# EAGLE design controller (EAGLE 6.5.0)
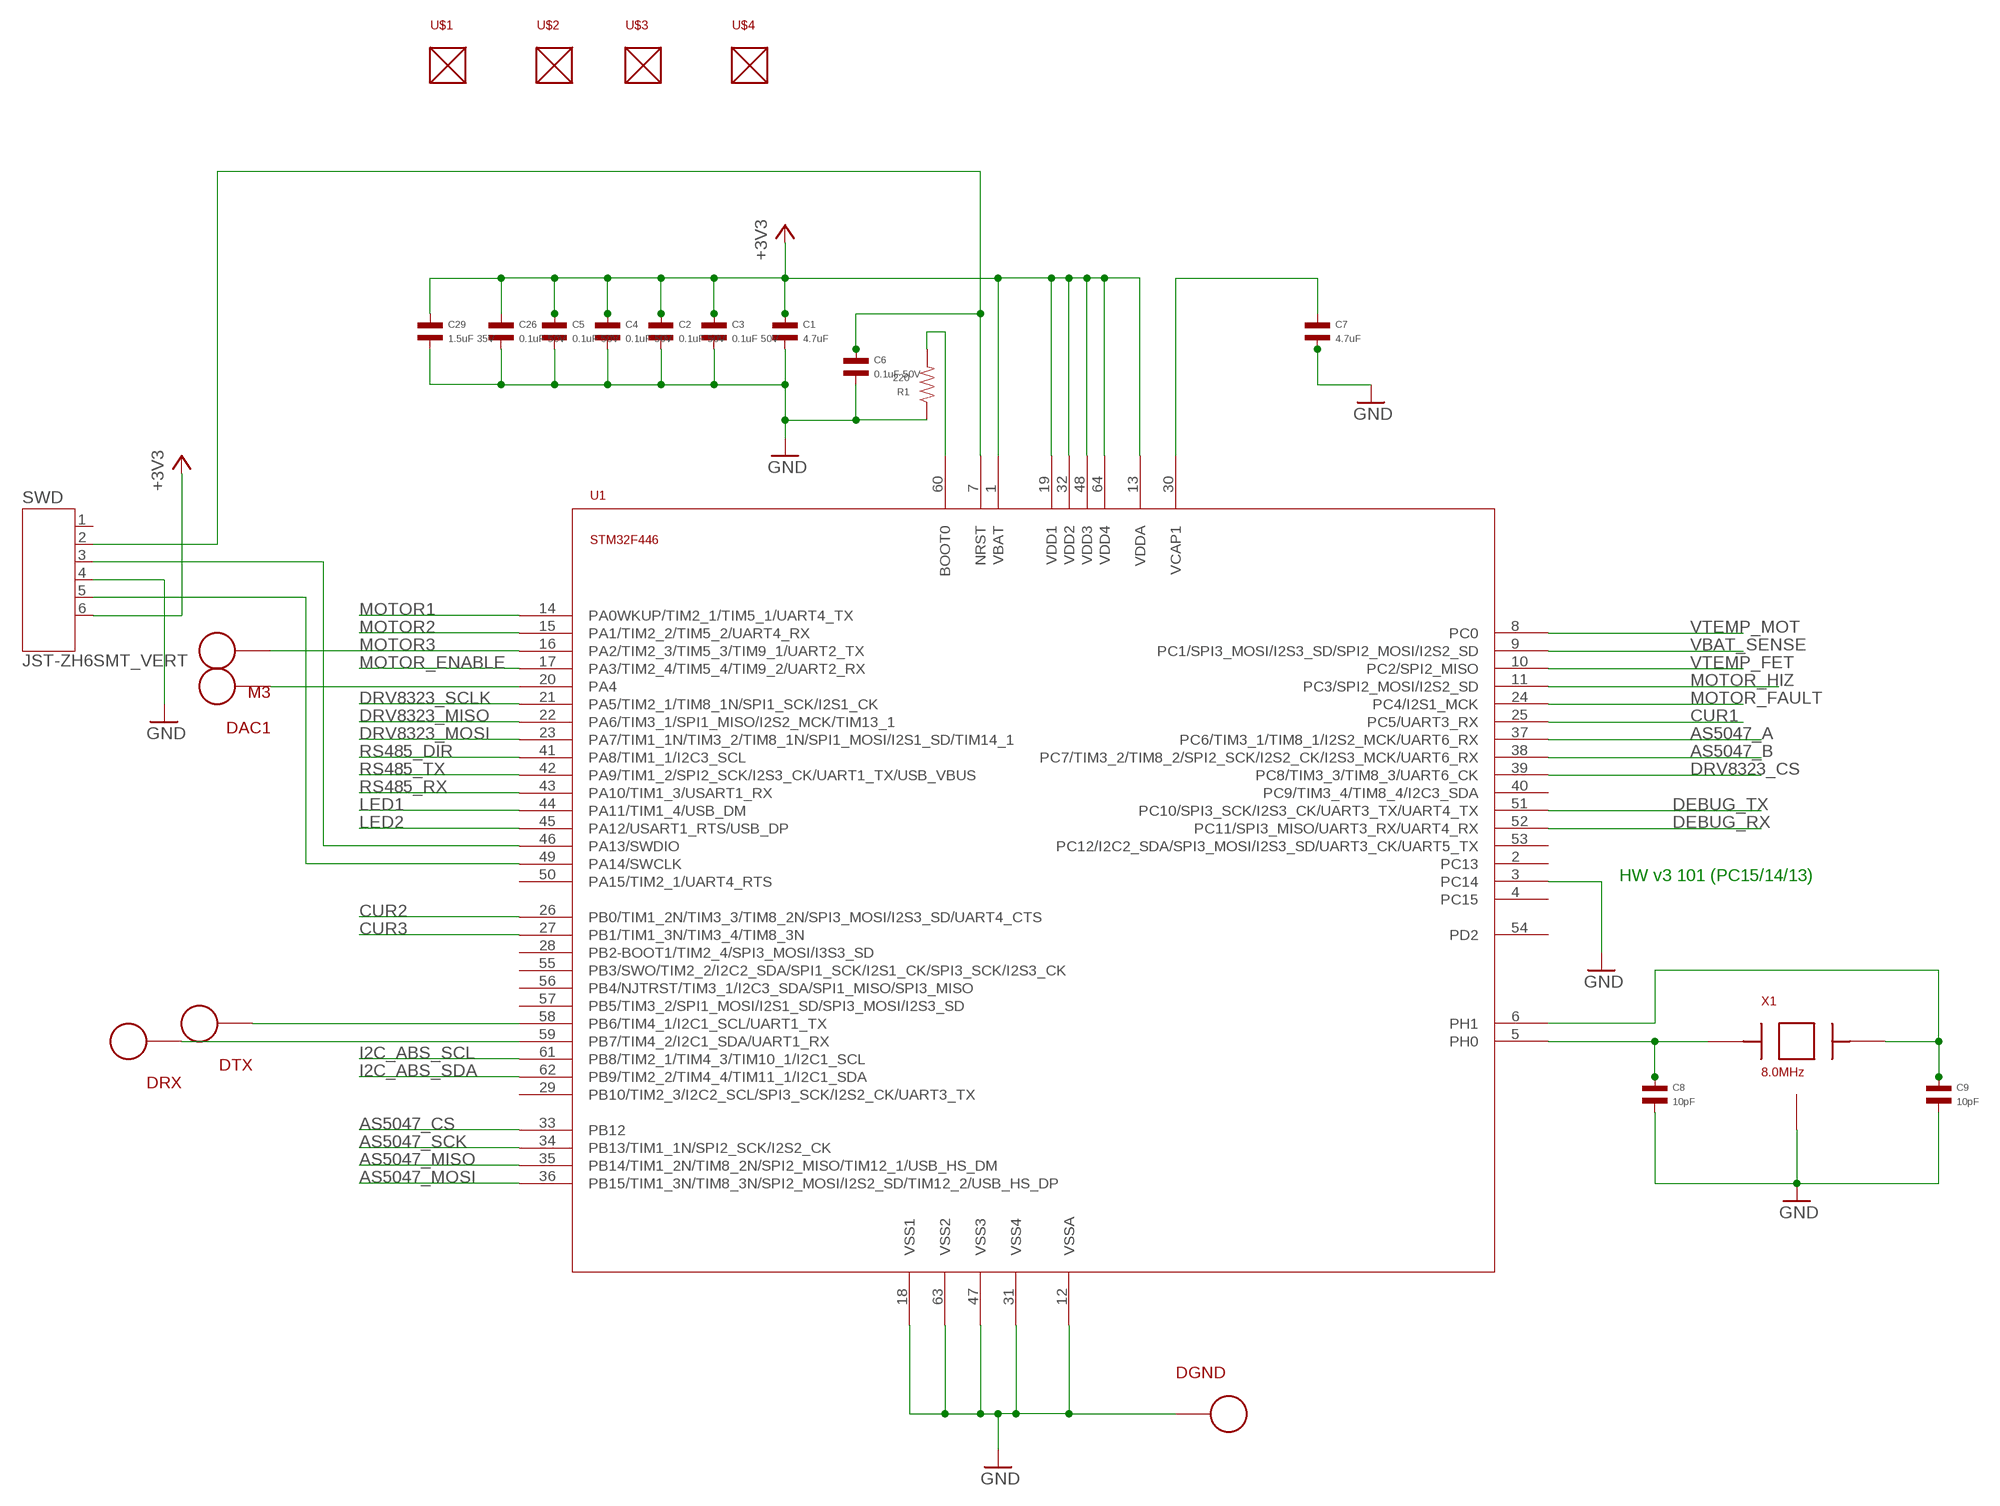
[diagram p0: schematic, sheet 1, part 1 of 2]
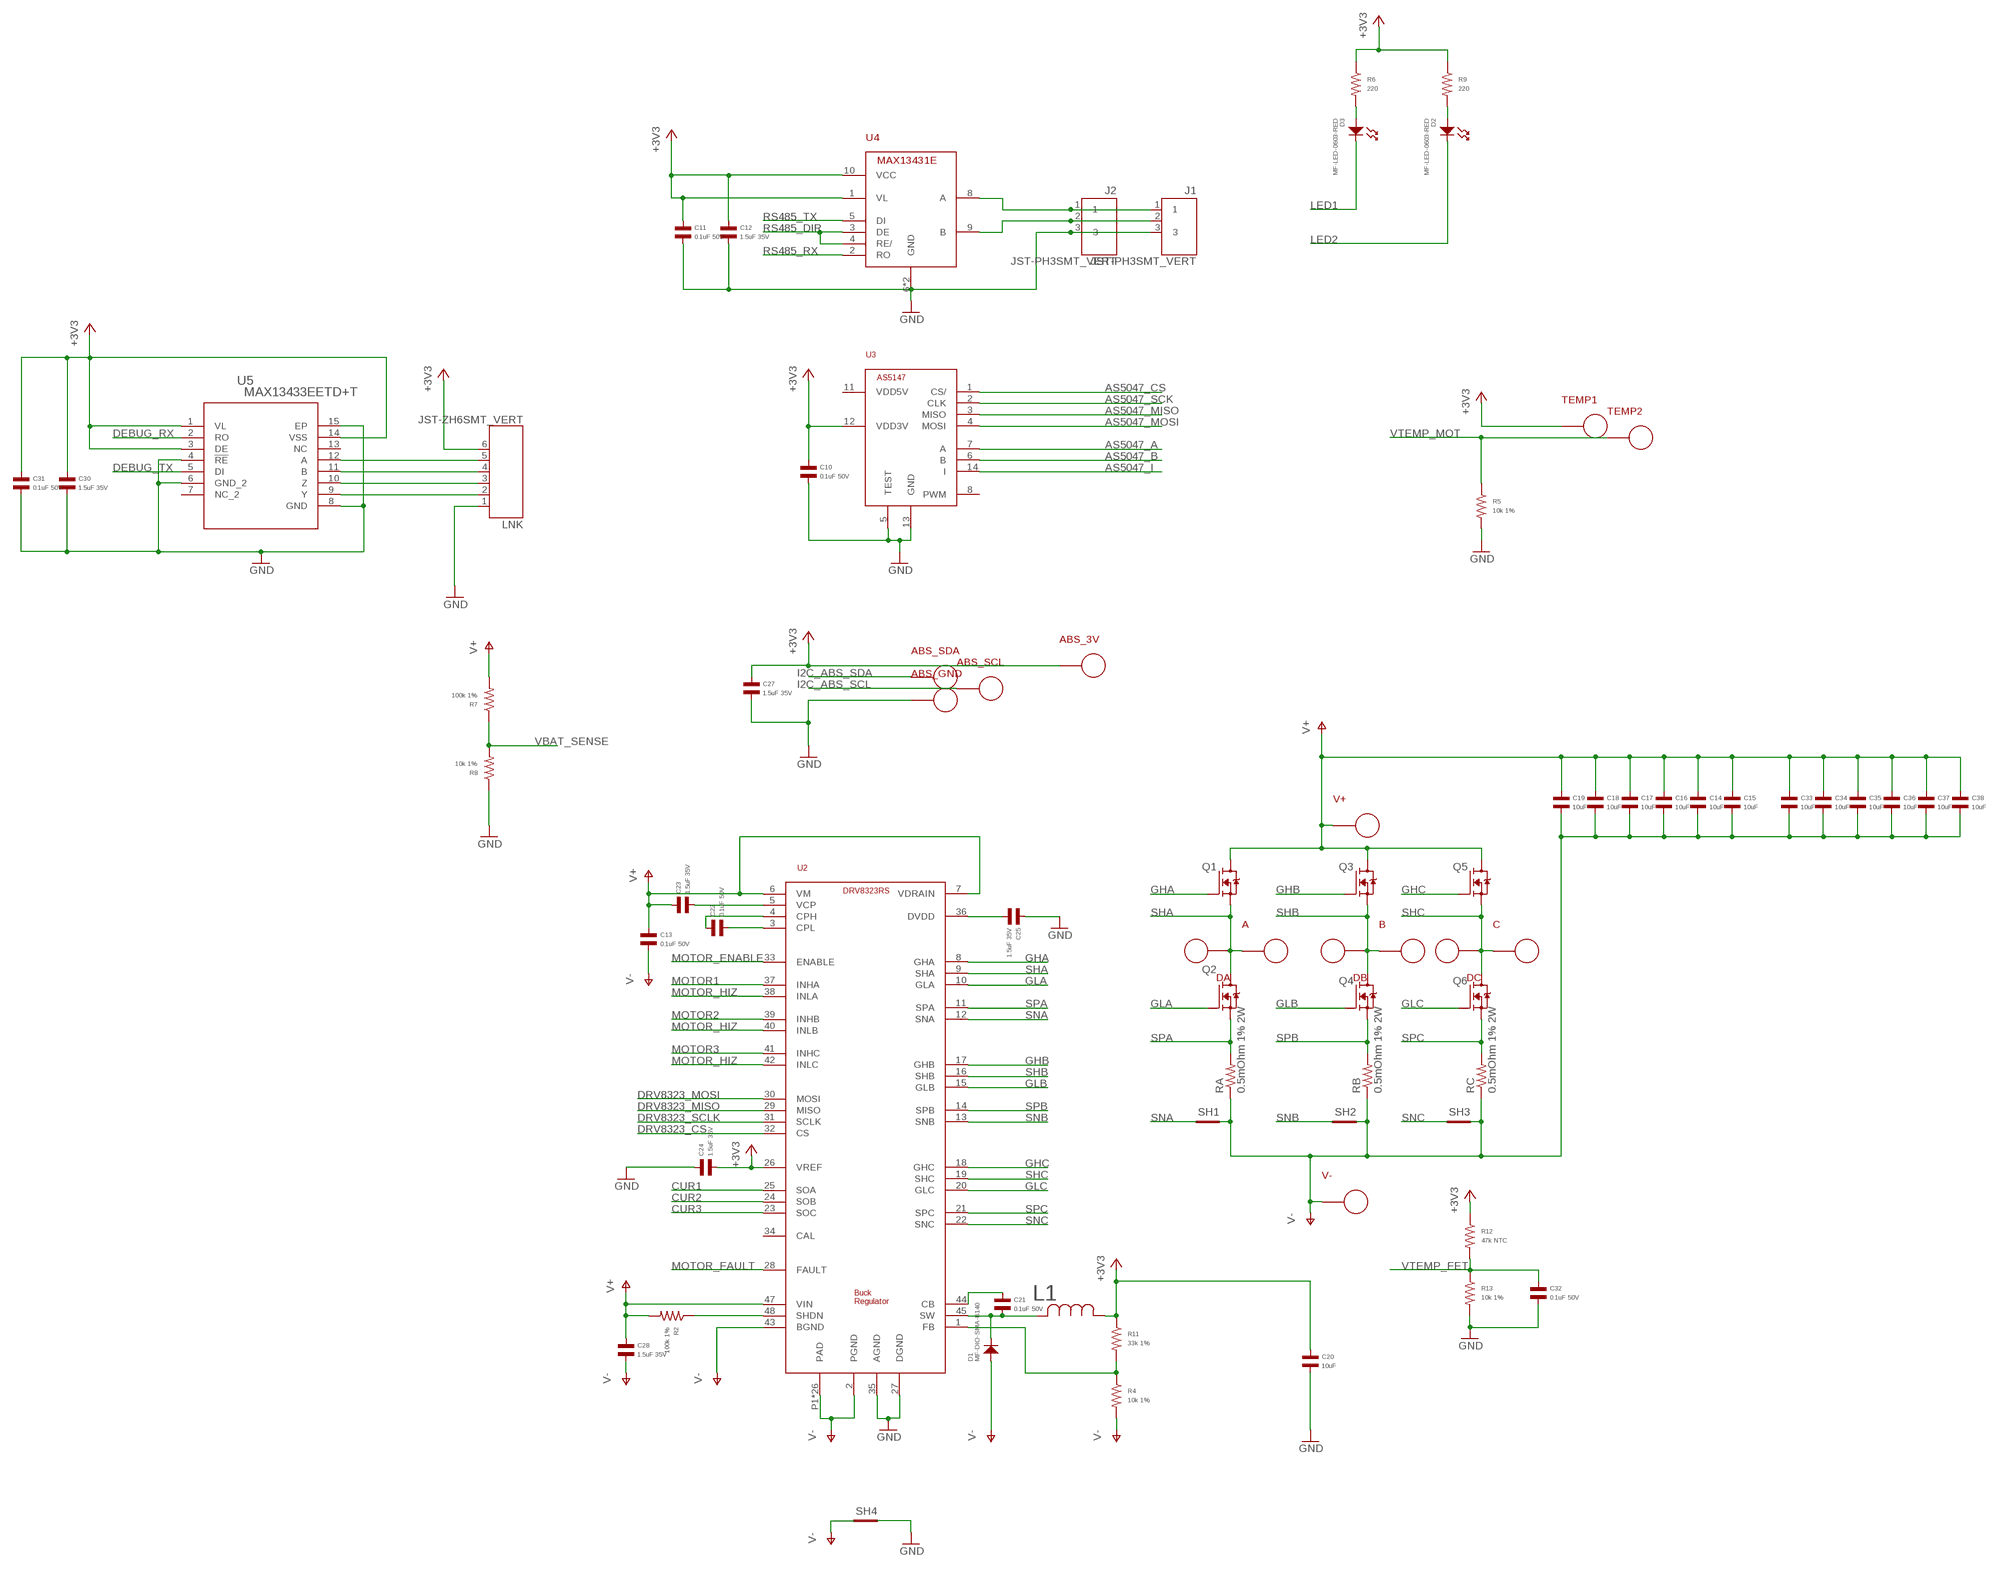
[diagram p1: schematic, sheet 1, part 2 of 2]

## Parts
A  PAD  [18AWG_PAD]
ABS_3V  PAD24AWG_PAD  [24AWG_PAD]
ABS_GND  PAD24AWG_PAD  [24AWG_PAD]
ABS_SCL  PAD24AWG_PAD  [24AWG_PAD]
ABS_SDA  PAD24AWG_PAD  [24AWG_PAD]
B  PAD  [18AWG_PAD]
C  PAD  [18AWG_PAD]
C1  4.7uF  CAPACITOR_NP_0603  [C0603]
C2  0.1uF 50V  CAPACITOR_NP_0402  [C0402]
C3  0.1uF 50V  CAPACITOR_NP_0402  [C0402]
C4  0.1uF 50V  CAPACITOR_NP_0402  [C0402]
C5  0.1uF 50V  CAPACITOR_NP_0402  [C0402]
C6  0.1uF 50V  CAPACITOR_NP_0402  [C0402]
C7  4.7uF  CAPACITOR_NP_0603  [C0603]
C8  10pF  CAPACITOR_NP_0402  [C0402]
C9  10pF  CAPACITOR_NP_0402  [C0402]
C10  0.1uF 50V  CAPACITOR_NP_0402  [C0402]
C11  0.1uF 50V  CAPACITOR_NP_0402  [C0402]
C12  1.5uF 35V  CAPACITOR_NP_0402  [C0402]
C13  0.1uF 50V  CAPACITOR_NP_0402  [C0402]
C14  10uF  CAPACITOR_NP_1206  [C1206]
C15  10uF  CAPACITOR_NP_1206  [C1206]
C16  10uF  CAPACITOR_NP_1206  [C1206]
C17  10uF  CAPACITOR_NP_1206  [C1206]
C18  10uF  CAPACITOR_NP_1206  [C1206]
C19  10uF  CAPACITOR_NP_1206  [C1206]
C20  10uF  CAPACITOR_NP_1206  [C1206]
C21  0.1uF 50V  CAPACITOR_NP_0402  [C0402]
C22  0.1uF 50V  CAPACITOR_NP_0402  [C0402]
C23  1.5uF 35V  CAPACITOR_NP_0402  [C0402]
C24  1.5uF 35V  CAPACITOR_NP_0402  [C0402]
C25  1.5uF 35V  CAPACITOR_NP_0402  [C0402]
C26  0.1uF 50V  CAPACITOR_NP_0402  [C0402]
C27  1.5uF 35V  CAPACITOR_NP_0402  [C0402]
C28  1.5uF 35V  CAPACITOR_NP_0402  [C0402]
C29  1.5uF 35V  CAPACITOR_NP_0402  [C0402]
C30  1.5uF 35V  CAPACITOR_NP_0402  [C0402]
C31  0.1uF 50V  CAPACITOR_NP_0402  [C0402]
C32  0.1uF 50V  CAPACITOR_NP_0402  [C0402]
C33  10uF  CAPACITOR_NP_1206  [C1206]
C34  10uF  CAPACITOR_NP_1206  [C1206]
C35  10uF  CAPACITOR_NP_1206  [C1206]
C36  10uF  CAPACITOR_NP_1206  [C1206]
C37  10uF  CAPACITOR_NP_1206  [C1206]
C38  10uF  CAPACITOR_NP_1206  [C1206]
D1  MF-DIO-SMA-B140  DIODES_B140_SMA  [SMA]
D2  MF-LED-0603-RED  LED_SINGLE-0603-RED  [LED0603]
D3  MF-LED-0603-RED  LED_SINGLE-0603-RED  [LED0603]
DA  PAD24AWG_PAD  [24AWG_PAD]
DAC1  PAD24AWG_PAD  [24AWG_PAD]
DB  PAD24AWG_PAD  [24AWG_PAD]
DC  PAD24AWG_PAD  [24AWG_PAD]
DGND  PAD24AWG_PAD  [24AWG_PAD]
DRX  PAD24AWG_PAD  [24AWG_PAD]
DTX  PAD24AWG_PAD  [24AWG_PAD]
J1  JST-PH3SMT_VERT  [JST_B3B_PH-SM4-TB(LF)(SN)]
J2  JST-PH3SMT_VERT  [JST_B3B_PH-SM4-TB(LF)(SN)]
L1  SRN4018-220M  [IND_BOURNS_SRN4018]
LNK  JST-ZH6SMT_VERT  [JST_B6B-ZR-SM4-TF(LF)(SN)]
M3  PAD24AWG_PAD  [24AWG_PAD]
Q1  TPN1R603PL  [TSON_ADVANCE_8]
Q2  TPN1R603PL  [TSON_ADVANCE_8]
Q3  TPN1R603PL  [TSON_ADVANCE_8]
Q4  TPN1R603PL  [TSON_ADVANCE_8]
Q5  TPN1R603PL  [TSON_ADVANCE_8]
Q6  TPN1R603PL  [TSON_ADVANCE_8]
R1  220  RESISTOR_0402  [R0402]
R2  100k 1%  RESISTOR_0402  [R0402]
R4  10k 1%  RESISTOR_0402  [R0402]
R5  10k 1%  RESISTOR_0402  [R0402]
R6  220  RESISTOR_0402  [R0402]
R7  100k 1%  RESISTOR_0402  [R0402]
R8  10k 1%  RESISTOR_0402  [R0402]
R9  220  RESISTOR_0402  [R0402]
R11  33k 1%  RESISTOR_0402  [R0402]
R12  47k NTC  RESISTOR_0402  [R0402]
R13  10k 1%  RESISTOR_0402  [R0402]
RA  0.5mOhm 1% 2W  R-US_M1206  [M1206]
RB  0.5mOhm 1% 2W  R-US_M1206  [M1206]
RC  0.5mOhm 1% 2W  R-US_M1206  [M1206]
SH1  SHORTT5  [SHORT_TOP-50]
SH2  SHORTT5  [SHORT_TOP-50]
SH3  SHORTT5  [SHORT_TOP-50]
SH4  SHORTBIG  [SHORT_TOP-BIG]
SWD  JST-ZH6SMT_VERT  [JST_B6B-ZR-SM4-TF(LF)(SN)]
TEMP1  PAD24AWG_PAD  [24AWG_PAD]
TEMP2  PAD24AWG_PAD  [24AWG_PAD]
U1  STM32F4R_64PIN  [LQFP64]
U2  DRV8323RS  [PVQFN-N48]
U3  AS5147  [TSSOP14]
U4  MAX13431E  [TDFN10]
U5  MAX13433EETD+T  [21-0137I_T1433-1]
U$1  MOUNTM2  [M2MOUNT]
U$2  MOUNTM2  [M2MOUNT]
U$3  MOUNTM2  [M2MOUNT]
U$4  MOUNTM2  [M2MOUNT]
V+  PAD12AWG_PAD  [12AWG_PAD]
V-  PAD12AWG_PAD  [12AWG_PAD]
X1  8.0MHz  CRYSTALABM3B  [ABM3B]

## Nets
+3V3: ABS_3V.P$1 C1.P$1 C2.P$1 C3.P$1 C4.P$1 C5.P$1 C10.P$1 C11.P$1 C12.P$1 C20.P$1 C24.P$2 C26.P$1 C27.P$1 C29.P$1 C30.P$1 C31.P$1 L1.1 LNK.6 R6.P$1 R9.P$1 R11.P$1 R12.P$1 SWD.6 TEMP1.P$1 U1.1(VBAT) U1.13(VDDA) U1.19(VDD1) U1.32(VDD2) U1.48(VDD3) U1.64(VDD4) U2.26(VREF) U3.12(VDD3V) U4.1(VL) U4.10(VCC) U5.1(VL) U5.3(DE) U5.14(VSS)
AS5047_A: U1.37(PC6/TIM3_1/TIM8_1/I2S2_MCK/UART6_RX) U3.7(A)
AS5047_B: U1.38(PC7/TIM3_2/TIM8_2/SPI2_SCK/I2S2_CK/I2S3_MCK/UART6_RX) U3.6(B)
AS5047_CS: U1.33(PB12) U3.1(CS/)
AS5047_I: U3.14(I)
AS5047_MISO: U1.35(PB14/TIM1_2N/TIM8_2N/SPI2_MISO/TIM12_1/USB_HS_DM) U3.3(MISO)
AS5047_MOSI: U1.36(PB15/TIM1_3N/TIM8_3N/SPI2_MOSI/I2S2_SD/TIM12_2/USB_HS_DP) U3.4(MOSI)
AS5047_SCK: U1.34(PB13/TIM1_1N/SPI2_SCK/I2S2_CK) U3.2(CLK)
CUR1: U1.25(PC5/UART3_RX) U2.25(SOA)
CUR2: U1.26(PB0/TIM1_2N/TIM3_3/TIM8_2N/SPI3_MOSI/I2S3_SD/UART4_CTS) U2.24(SOB)
CUR3: U1.27(PB1/TIM1_3N/TIM3_4/TIM8_3N) U2.23(SOC)
DBG_A: LNK.5 U5.12(A)
DBG_B: LNK.4 U5.11(B)
DBG_Y: LNK.2 U5.9(Y)
DBG_Z: LNK.3 U5.10(Z)
DEBUG_RX: U1.52(PC11/SPI3_MISO/UART3_RX/UART4_RX) U5.2(RO)
DEBUG_TX: U1.51(PC10/SPI3_SCK/I2S3_CK/UART3_TX/UART4_TX) U5.5(DI)
DRV8323_CS: U1.39(PC8/TIM3_3/TIM8_3/UART6_CK) U2.32(CS)
DRV8323_MISO: U1.22(PA6/TIM3_1/SPI1_MISO/I2S2_MCK/TIM13_1) U2.29(MISO)
DRV8323_MOSI: U1.23(PA7/TIM1_1N/TIM3_2/TIM8_1N/SPI1_MOSI/I2S1_SD/TIM14_1) U2.30(MOSI)
DRV8323_SCLK: U1.21(PA5/TIM2_1/TIM8_1N/SPI1_SCK/I2S1_CK) U2.31(SCLK)
GHA: Q1.4(G) U2.8(GHA)
GHB: Q3.4(G) U2.17(GHB)
GHC: Q5.4(G) U2.18(GHC)
GLA: Q2.4(G) U2.10(GLA)
GLB: Q4.4(G) U2.15(GLB)
GLC: Q6.4(G) U2.20(GLC)
GND: ABS_GND.P$1 C1.P$2 C2.P$2 C3.P$2 C4.P$2 C5.P$2 C6.P$2 C7.P$2 C8.P$2 C9.P$2 C10.P$2 C11.P$2 C12.P$2 C20.P$2 C24.P$1 C25.P$1 C26.P$2 C27.P$2 C29.P$2 C30.P$2 C31.P$2 C32.P$2 DGND.P$1 J1.3 J2.3 LNK.1 R1.P$1 R5.P$2 R8.P$1 R13.P$2 SH4.2 SWD.4 U1.3(PC14) U1.12(VSSA) U1.18(VSS1) U1.31(VSS4) U1.47(VSS3) U1.63(VSS2) U2.27(DGND) U2.35(AGND) U3.5(TEST) U3.13(GND) U4.6(GND) U4.PAD(GND) U5.4(!RE) U5.6(GND_2) U5.8(GND) U5.15(EP) X1.2 X1.4
I2C_ABS_SCL: ABS_SCL.P$1 U1.61(PB8/TIM2_1/TIM4_3/TIM10_1/I2C1_SCL)
I2C_ABS_SDA: ABS_SDA.P$1 U1.62(PB9/TIM2_2/TIM4_4/TIM11_1/I2C1_SDA)
LED1: D3.CATHODE U1.44(PA11/TIM1_4/USB_DM)
LED2: D2.CATHODE U1.45(PA12/USART1_RTS/USB_DP)
MOTOR1: U1.14(PA0WKUP/TIM2_1/TIM5_1/UART4_TX) U2.37(INHA)
MOTOR2: U1.15(PA1/TIM2_2/TIM5_2/UART4_RX) U2.39(INHB)
MOTOR3: M3.P$1 U1.16(PA2/TIM2_3/TIM5_3/TIM9_1/UART2_TX) U2.41(INHC)
MOTOR_ENABLE: U1.17(PA3/TIM2_4/TIM5_4/TIM9_2/UART2_RX) U2.33(ENABLE)
MOTOR_FAULT: U1.24(PC4/I2S1_MCK) U2.28(FAULT)
MOTOR_HIZ: U1.11(PC3/SPI2_MOSI/I2S2_SD) U2.38(INLA) U2.40(INLB) U2.42(INLC)
N$1: DAC1.P$1 U1.20(PA4)
N$2: DTX.P$1 U1.58(PB6/TIM4_1/I2C1_SCL/UART1_TX)
N$3: DRX.P$1 U1.59(PB7/TIM4_2/I2C1_SDA/UART1_RX)
N$5: R2.P$1 U2.48(SHDN)
N$6: SWD.5 U1.49(PA14/SWCLK)
N$7: SWD.3 U1.46(PA13/SWDIO)
N$8: R4.P$1 R11.P$2 U2.1(FB)
N$9: J1.2 J2.2 U4.9(B)
N$10: C22.P$2 U2.3(CPL)
N$11: C21.P$2 D1.CATHODE L1.2 U2.45(SW)
N$12: C21.P$1 U2.44(CB)
N$13: C22.P$1 U2.4(CPH)
N$14: C23.P$2 U2.5(VCP)
N$15: J1.1 J2.1 U4.8(A)
N$16: C25.P$2 U2.36(DVDD)
N$17: D3.ANODE R6.P$2
N$18: D2.ANODE R9.P$2
N$23: C7.P$1 U1.30(VCAP1)
N$24: C6.P$1 SWD.2 U1.7(NRST)
N$33: R1.P$2 U1.60(BOOT0)
N$35: C8.P$1 U1.5(PH0) X1.1
N$36: C9.P$1 U1.6(PH1) X1.3
RS485_DIR: U1.41(PA8/TIM1_1/I2C3_SCL) U4.3(DE) U4.4(RE/)
RS485_RX: U1.43(PA10/TIM1_3/USART1_RX) U4.2(RO)
RS485_TX: U1.42(PA9/TIM1_2/SPI2_SCK/I2S3_CK/UART1_TX/USB_VBUS) U4.5(DI)
SHA: A.1 DA.P$1 Q1.1(S) Q1.2(S) Q1.3(S) Q2.5(D) Q2.6(D) Q2.7(D) Q2.8(D) Q2.PAD(D) U2.9(SHA)
SHB: B.1 DB.P$1 Q3.1(S) Q3.2(S) Q3.3(S) Q4.5(D) Q4.6(D) Q4.7(D) Q4.8(D) Q4.PAD(D) U2.16(SHB)
SHC: C.1 DC.P$1 Q5.1(S) Q5.2(S) Q5.3(S) Q6.5(D) Q6.6(D) Q6.7(D) Q6.8(D) Q6.PAD(D) U2.19(SHC)
SNA: SH1.1 U2.12(SNA)
SNB: SH2.1 U2.13(SNB)
SNC: SH3.1 U2.22(SNC)
SPA: Q2.1(S) Q2.2(S) Q2.3(S) RA.2 U2.11(SPA)
SPB: Q4.1(S) Q4.2(S) Q4.3(S) RB.2 U2.14(SPB)
SPC: Q6.1(S) Q6.2(S) Q6.3(S) RC.2 U2.21(SPC)
V+: C13.P$1 C14.P$1 C15.P$1 C16.P$1 C17.P$1 C18.P$1 C19.P$1 C23.P$1 C28.P$1 C33.P$1 C34.P$1 C35.P$1 C36.P$1 C37.P$1 C38.P$1 Q1.5(D) Q1.6(D) Q1.7(D) Q1.8(D) Q1.PAD(D) Q3.5(D) Q3.6(D) Q3.7(D) Q3.8(D) Q3.PAD(D) Q5.5(D) Q5.6(D) Q5.7(D) Q5.8(D) Q5.PAD(D) R2.P$2 R7.P$2 U2.6(VM) U2.7(VDRAIN) U2.47(VIN) V+.1
V-: C13.P$2 C14.P$2 C15.P$2 C16.P$2 C17.P$2 C18.P$2 C19.P$2 C28.P$2 C33.P$2 C34.P$2 C35.P$2 C36.P$2 C37.P$2 C38.P$2 D1.ANODE R4.P$2 RA.1 RB.1 RC.1 SH1.2 SH2.2 SH3.2 SH4.1 U2.2(PGND) U2.43(BGND) U2.P1(PAD) U2.P2(PAD) U2.P3(PAD) U2.P4(PAD) U2.P5(PAD) U2.P6(PAD) U2.P7(PAD) U2.P8(PAD) U2.P9(PAD) U2.P10(PAD) U2.P11(PAD) U2.P12(PAD) U2.P13(PAD) U2.P14(PAD) U2.P15(PAD) U2.P16(PAD) U2.P17(PAD) U2.P18(PAD) U2.P19(PAD) U2.P20(PAD) U2.P21(PAD) U2.P22(PAD) U2.P23(PAD) U2.P24(PAD) U2.P25(PAD) U2.PAD V-.1
VBAT_SENSE: R7.P$1 R8.P$2 U1.9(PC1/SPI3_MOSI/I2S3_SD/SPI2_MOSI/I2S2_SD)
VTEMP_FET: C32.P$1 R12.P$2 R13.P$1 U1.10(PC2/SPI2_MISO)
VTEMP_MOT: R5.P$1 TEMP2.P$1 U1.8(PC0)
Unconnected: SWD.1 U1.2(PC13) U1.4(PC15) U1.28(PB2-BOOT1/TIM2_4/SPI3_MOSI/I3S3_SD) U1.29(PB10/TIM2_3/I2C2_SCL/SPI3_SCK/I2S2_CK/UART3_TX) U1.40(PC9/TIM3_4/TIM8_4/I2C3_SDA) U1.50(PA15/TIM2_1/UART4_RTS) U1.53(PC12/I2C2_SDA/SPI3_MOSI/I2S3_SD/UART3_CK/UART5_TX) U1.54(PD2) U1.55(PB3/SWO/TIM2_2/I2C2_SDA/SPI1_SCK/I2S1_CK/SPI3_SCK/I2S3_CK) U1.56(PB4/NJTRST/TIM3_1/I2C3_SDA/SPI1_MISO/SPI3_MISO) U1.57(PB5/TIM3_2/SPI1_MOSI/I2S1_SD/SPI3_MOSI/I2S3_SD) U2.34(CAL) U3.8(PWM) U3.11(VDD5V) U5.7(NC_2) U5.13(NC)

## Notes on the sheet
- HW v3 101 (PC15/14/13)

## Library data of the parts
A B C V+ V- = controller:PAD; POPULATE: 0
ABS_3V ABS_GND ABS_SCL ABS_SDA DA DAC1 DB DC DGND DRX DTX M3 TEMP1 TEMP2 = controller:PAD
C1 C7 = mfpassives:CAPACITOR_NP: Library: MF_Passives Description: Device for Non-Polarized Capacitors. Manufacture part number (MPN) can be added via Attributes. Check https://factory.macrofab.com/parts for the house parts list.; MF: Samsung Electro-Mechanics; MPN: CL10A475MP8NNNC; POPULATE: 1
C2-C6 C10 C11 C13 C21 C22 C26 C31 C32 = mfpassives:CAPACITOR_NP: Library: MF_Passives Description: Device for Non-Polarized Capacitors. Manufacture part number (MPN) can be added via Attributes. Check https://factory.macrofab.com/parts for the house parts list.; MF: TDK; MPN: CGA2B3X7R1H104K050BB; POPULATE: 1
C8 C9 = mfpassives:CAPACITOR_NP: Library: MF_Passives Description: Device for Non-Polarized Capacitors. Manufacture part number (MPN) can be added via Attributes. Check https://factory.macrofab.com/parts for the house parts list.; MF: Samsung Electro-Mechanics; MPN: CL05C100JB51PNC; POPULATE: 1
C12 C23-C25 C27-C30 = mfpassives:CAPACITOR_NP: Library: MF_Passives Description: Device for Non-Polarized Capacitors. Manufacture part number (MPN) can be added via Attributes. Check https://factory.macrofab.com/parts for the house parts list.; MF: TDK; MPN: C1005X5R1V155M050BC; POPULATE: 1
C14-C20 C33-C38 = mfpassives:CAPACITOR_NP: Library: MF_Passives Description: Device for Non-Polarized Capacitors. Manufacture part number (MPN) can be added via Attributes. Check https://factory.macrofab.com/parts for the house parts list.; MF: TDK; MPN: CGA5L1X7R1V106K160AC; POPULATE: 1
D1 = mfdiscretesemi:DIODES: Library: MF_Discrete_Semiconductor Description: Device for Single Packaged Diodes.; HOUSEPART: YES; MPN: MF-DIO-SMA-B140; POPULATE: 1; URL: https://factory.macrofab.com/part/MF-DIO-SMA-B140
D2 D3 = mfleds:LED_SINGLE: Library: MF_LEDs Description: Device for Single LED Packages. Manufacture part number (MFG#) can be added via Attributes.; HOUSEPART: YES; MPN: MF-LED-0603-RED; POPULATE: 1; URL: https://factory.macrofab.com/part/MF-LED-0603-RED
J1 J2 = controller:JST-PH3; MF: JST; MPN: B3B-PH-SM4-TB(LF)(SN); POPULATE: 1
L1 = controller:SRN4018-220M; MANUFACTURER_PART_NUMBER: SRN4018220M; MPN: SRN4018-220M; POPULATE: 1; VENDOR: Bourns Electronics
LNK SWD = controller:JST-ZH6; MF: JST; MPN: B6B-ZR-SM4-TF(LF)(SN); POPULATE: 1
Q1-Q6 = controller:TPN1R603PL; MF: Toshiba; MPN: TPN1R603PL,L1Q; POPULATE: 1
R1 R6 R9 = mfpassives:RESISTOR: Library: MF_Passives Description: Device for Resistors. Manufacture part number (MPN), Voltage, Tolerance, and Wattage Rating can be added via Attributes. Check https://factory.macrofab.com/parts for the house parts list.; HOUSEPART: 1; MPN: MF-RES-0402-220; POPULATE: 1
R2 R7 = mfpassives:RESISTOR: Library: MF_Passives Description: Device for Resistors. Manufacture part number (MPN), Voltage, Tolerance, and Wattage Rating can be added via Attributes. Check https://factory.macrofab.com/parts for the house parts list.; MF: Panasonic; MPN: ERJ-2RKF1003X; POPULATE: 1
R4 R5 R8 R13 = mfpassives:RESISTOR: Library: MF_Passives Description: Device for Resistors. Manufacture part number (MPN), Voltage, Tolerance, and Wattage Rating can be added via Attributes. Check https://factory.macrofab.com/parts for the house parts list.; MF: Panasonic; MPN: ERJ-2RKF1002X; POPULATE: 1
R11 = mfpassives:RESISTOR: Library: MF_Passives Description: Device for Resistors. Manufacture part number (MPN), Voltage, Tolerance, and Wattage Rating can be added via Attributes. Check https://factory.macrofab.com/parts for the house parts list.; MF: Panasonic; MPN: ERJ-2RKF3302X; POPULATE: 1
R12 = mfpassives:RESISTOR: Library: MF_Passives Description: Device for Resistors. Manufacture part number (MPN), Voltage, Tolerance, and Wattage Rating can be added via Attributes. Check https://factory.macrofab.com/parts for the house parts list.; MF: Murata; MPN: NCP15WB473F03RC; POPULATE: 1
RA RB RC = rcl:R-US_: RESISTOR, American symbol; MF: Stackpole Electronics; MPN: HCS1206FTL500; POPULATE: 1
SH1-SH3 = shorts:SHORT: Short between two nets; BOM: no; POPULATE: 0
SH4 = shorts:SHORT: Short between two nets; POPULATE: 0
U1 = controller:STM32F4R_64PIN: 64-pin STM32F4 chip.; MF: ST; MPN: STM32F446RET6; POPULATE: 1
U2 = controller:DRV8323RS; MF: TI; MPN: DRV8323RSRGZR; POPULATE: 1
U3 = controller:AS5147; MF: AMS; MPN: AS5047P-ATSM; POPULATE: 1
U4 = controller:MAX13431E; MF: Maxim; MPN: MAX13431EETB+T; POPULATE: 1
U5 = controller:MAX13433EETD+T; MANUFACTURER_PART_NUMBER: MAX13433EETD+T; MF: Maxim; MPN: MAX13433EETD+T; POPULATE: 1; VENDOR: Maxim Integrated Products
U$1-U$4 = controller:MOUNT; POPULATE: 0
X1 = controller:CRYSTAL; MF: Abracon; MPN: ABM3B-8.000MHZ-10-1-U-T; POPULATE: 1

## Board
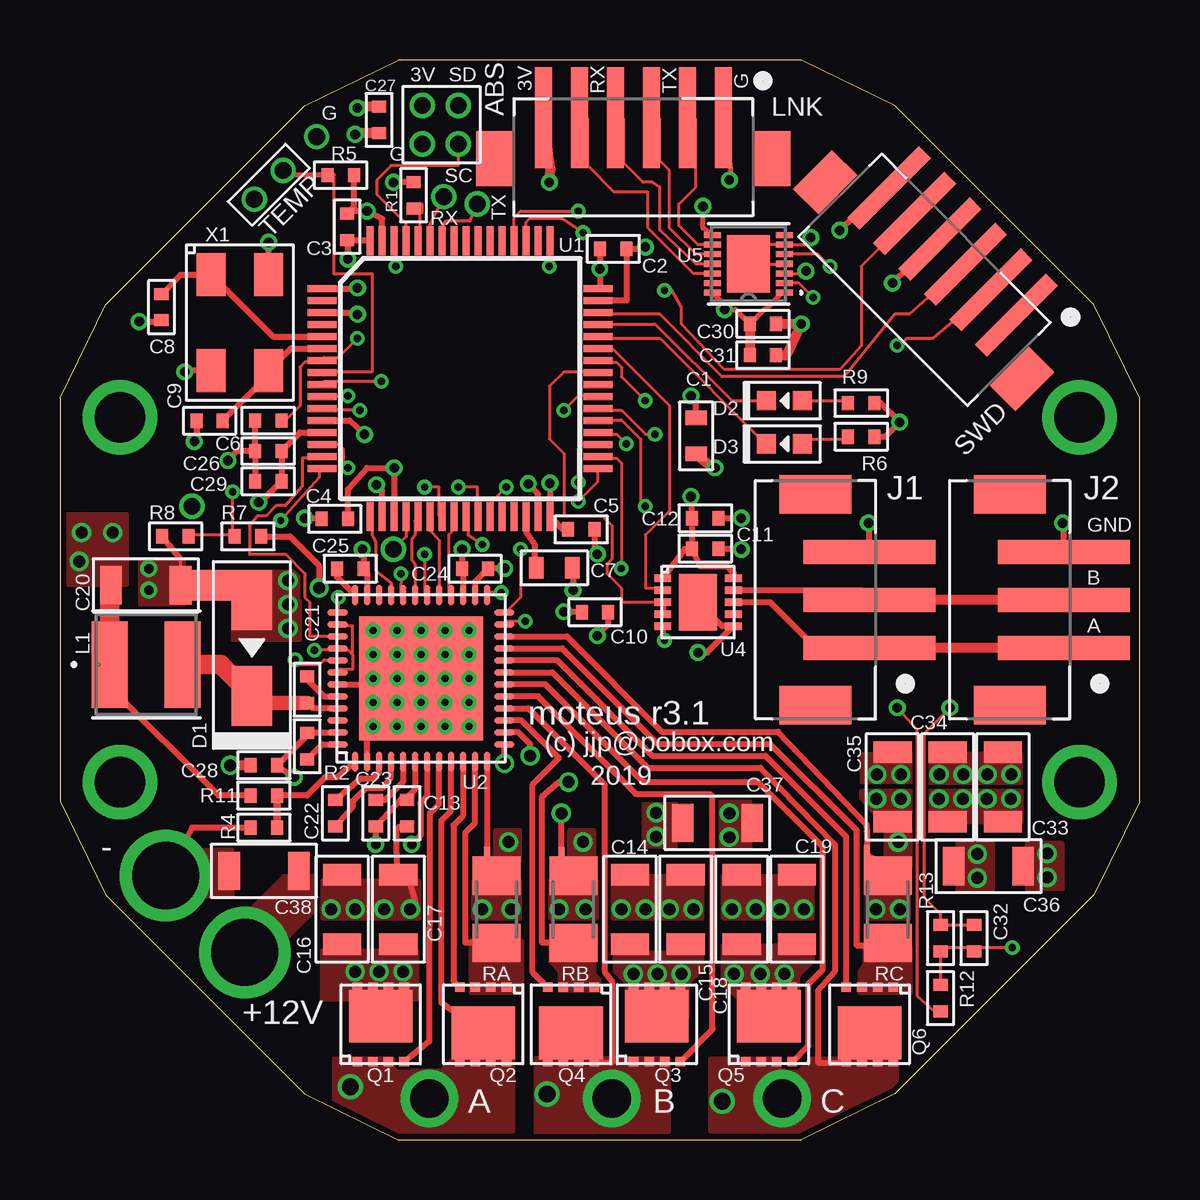
[diagram p2: board, top side]
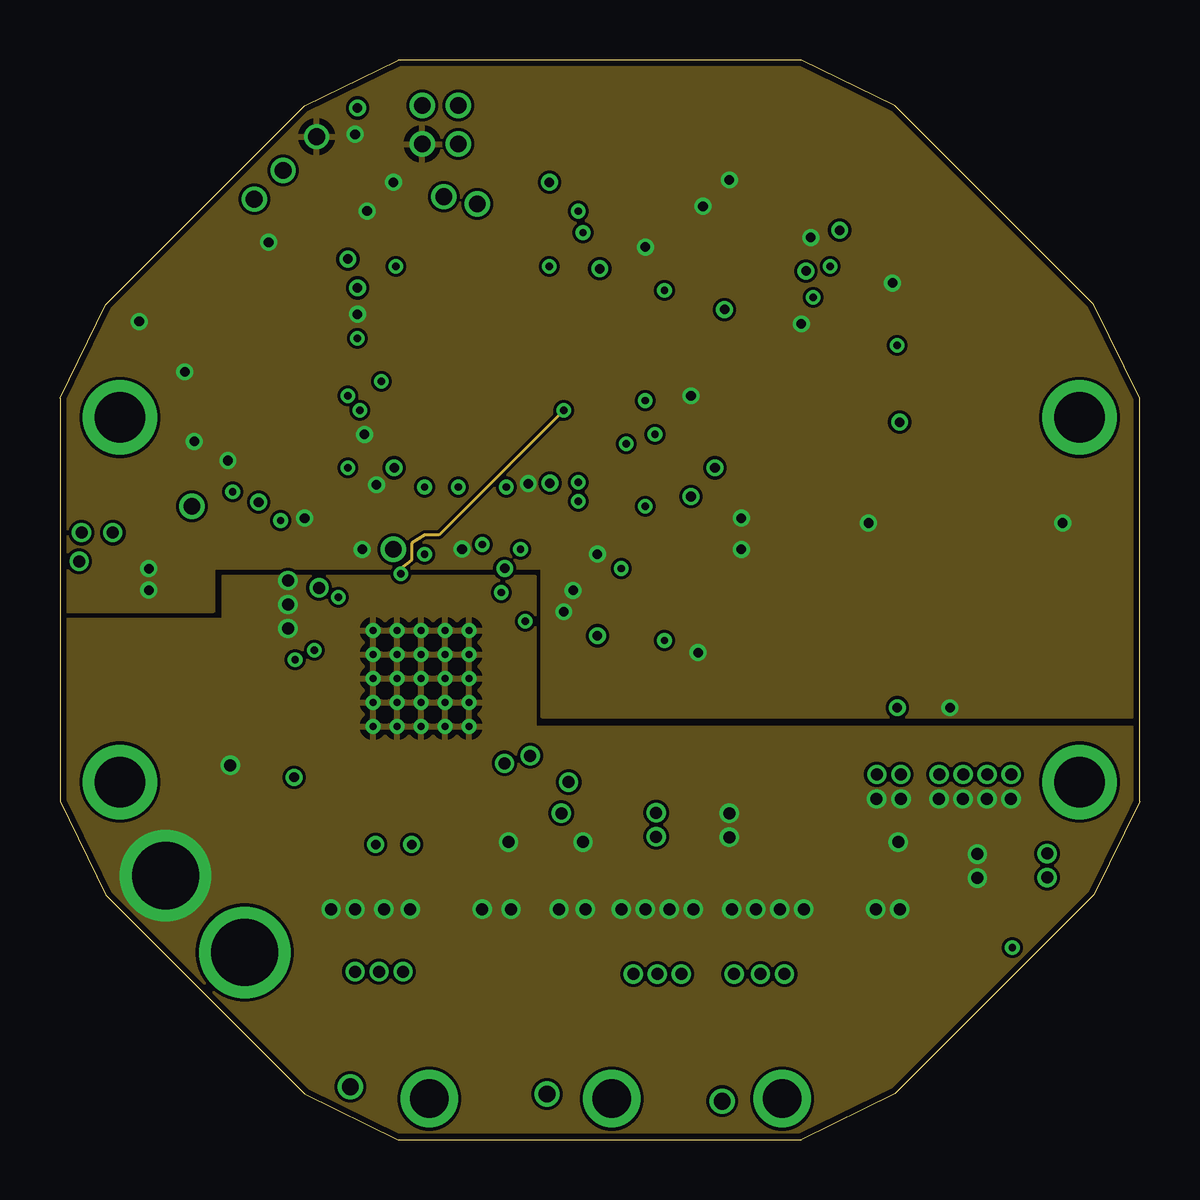
[diagram p3: board, inner layer Route2]
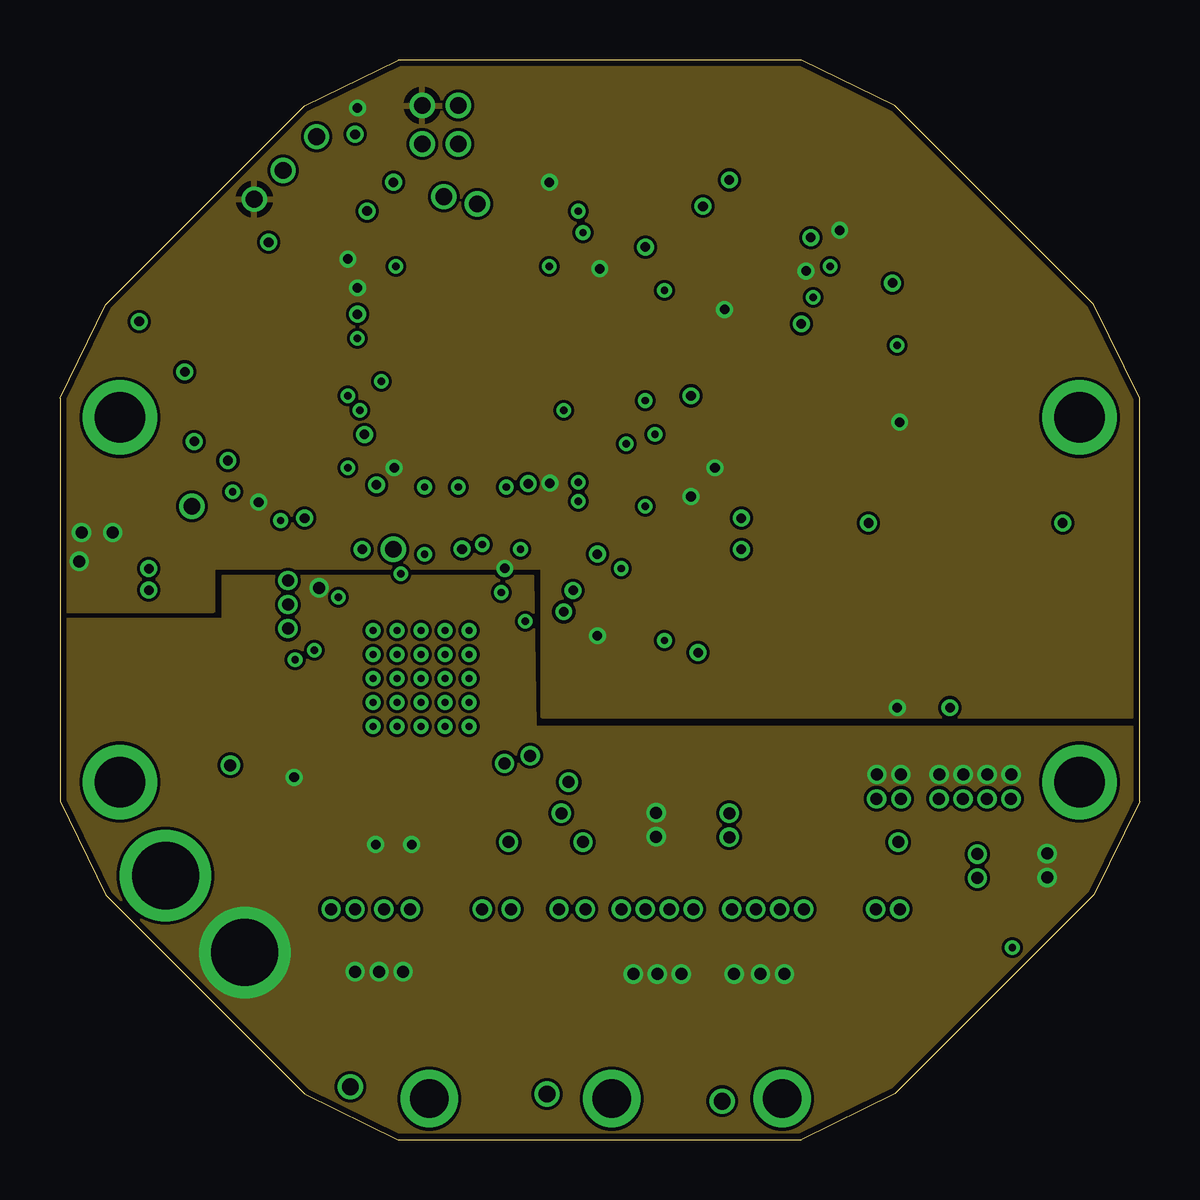
[diagram p4: board, inner layer Route15]
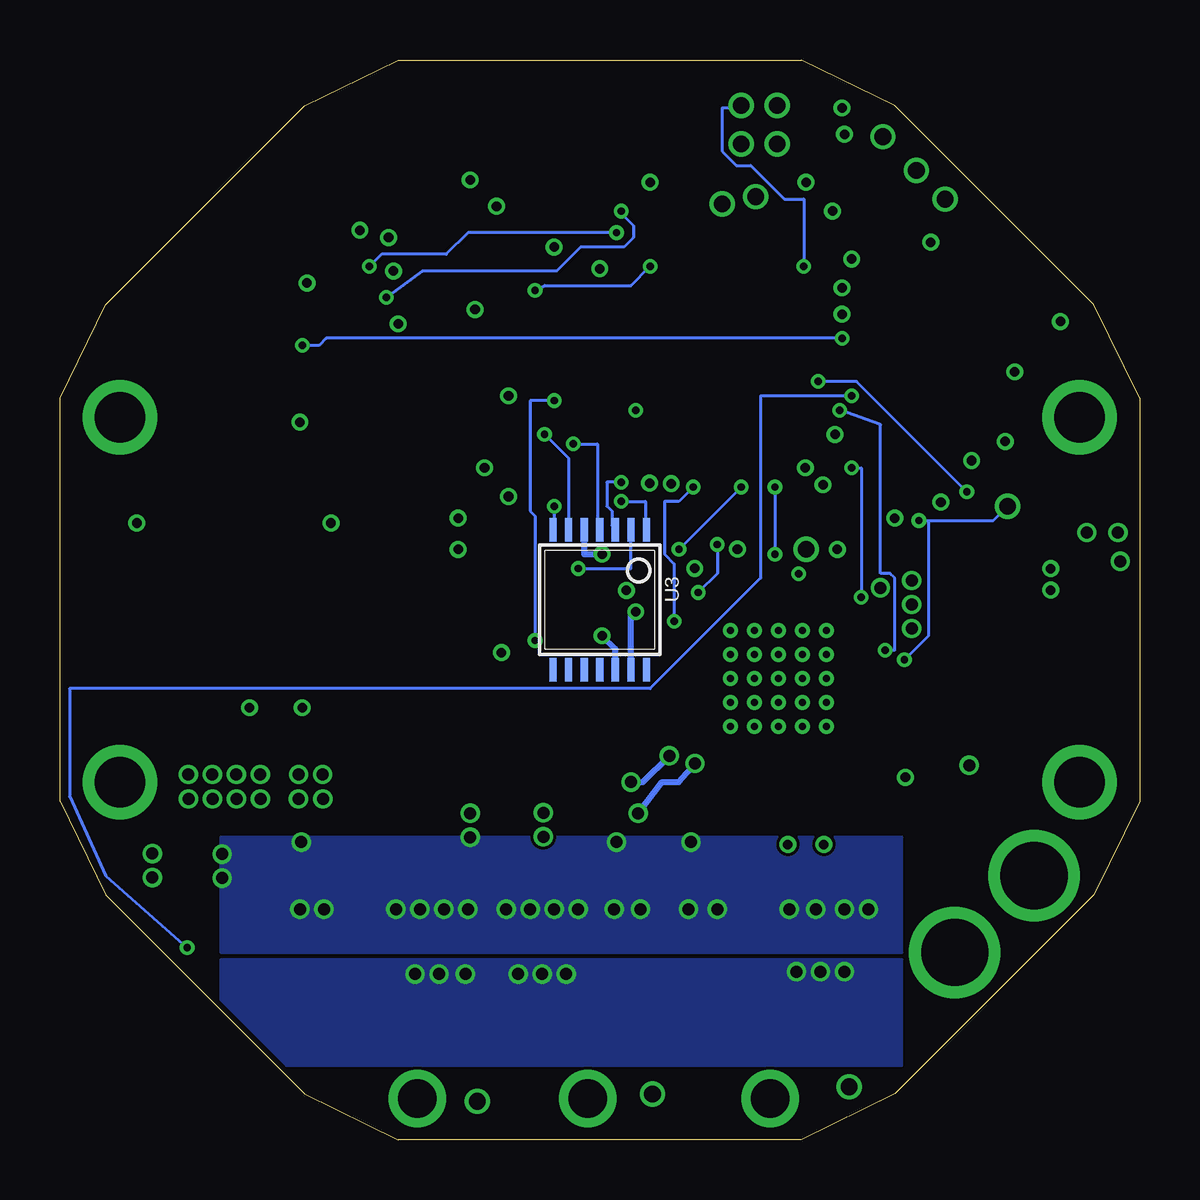
[diagram p5: board, bottom side, seen from below]

Size 45 x 45 mm. Coordinates in mm from the lower left corner, seen from the top.
Outline: 14.1,0 30.9,0 34.8,1.9 43.1,10.2 45,14.1 45,30.9 43.1,34.8 34.8,43.1 30.9,45 14.1,45 10.2,43.1 1.9,34.8 0,30.9 0,14.1 1.9,10.2 10.2,1.9 14.1,0
Copper layers (1*2*15*16): Top 0.035mm / dielectric 0.23mm / Route2 0.035mm / dielectric 0.93mm / Route15 0.035mm / dielectric 0.23mm / Bottom 0.035mm
Design rules "MF_Standard_4_Layer": minimum track width 5mil, minimum drill 12mil, track to track 5mil, track to pad 5mil, pad to pad 5mil, via to via 5mil, smd to smd 0mil, copper to edge 10mil, drill to drill 10mil, minimum pad ring 6mil, minimum via ring 6mil, stop-mask expansion 2mil, vias tented up to drill 25mil, thermal gap 10mil

### Footprints (pad centres in the part's own frame; a part is rotated, then mirrored left to right if it is on the bottom)
18AWG_PAD = drill 1.6: 1 0,0
24AWG_PAD = drill 0.7: P$1 0,0
C0603 = smd 0.6 x 0.9: P$1 -0.75,0; P$2 0.75,0
C0402 = smd 0.5 x 0.6: P$1 -0.55,0; P$2 0.55,0
C1206 = smd 0.9 x 1.6: P$1 -1.45,0; P$2 1.45,0
SMA = smd 2.5 x 1.7: ANODE 2,0; CATHODE -2,0
LED0603 = smd 0.8 x 0.8: ANODE 0.75,0; CATHODE -0.75,0
JST_B3B_PH-SM4-TB(LF)(SN) = smd 1 x 5.5: 1 -2,-2.54; 2 0,-2.54; 3 2,-2.54 | smd 1.6 x 3: P1 -4.4,-0.29; P2 4.4,-0.29
IND_BOURNS_SRN4018 = smd 1.499 x 3.607: 1 -1.524,0; 2 1.524,0
JST_B6B-ZR-SM4-TF(LF)(SN) = smd 0.7 x 4.2: 1 -3.75,-2; 2 -2.25,-2; 3 -0.75,-2; 4 0.75,-2; 5 2.25,-2; 6 3.75,-2 | smd 1.5 x 2.3: P1 -5.8,-0.29; P2 5.8,-0.29
TSON_ADVANCE_8 = smd 0.4 x 0.4: 1 -0.975,-1.55; 2 -0.325,-1.55; 3 0.325,-1.55; 4 0.975,-1.55; 5 0.975,1.55; 6 0.325,1.55; 7 -0.325,1.55; 8 -0.975,1.55 | smd 2.65 x 2.2: PAD 0,0.35
R0402 = smd 0.5 x 0.6: P$1 -0.55,0; P$2 0.55,0
M1206 = smd 1.6 x 2: 1 -1.4,0; 2 1.4,0
SHORT_TOP-50 = smd 0.254 x 0.254: 1 0.127,0; 2 -0.127,0
SHORT_TOP-BIG = smd 1.27 x 1.27: 1 0.635,0; 2 -0.635,0
LQFP64 = smd 1.2 x 0.3: 1 -5.75,3.75; 2 -5.75,3.25; 3 -5.75,2.75; 4 -5.75,2.25; 5 -5.75,1.75; 6 -5.75,1.25; 7 -5.75,0.75; 8 -5.75,0.25; 9 -5.75,-0.25; 10 -5.75,-0.75; 11 -5.75,-1.25; 12 -5.75,-1.75; 13 -5.75,-2.25; 14 -5.75,-2.75; 15 -5.75,-3.25; 16 -5.75,-3.75; 33 5.75,-3.75; 34 5.75,-3.25; 35 5.75,-2.75; 36 5.75,-2.25; 37 5.75,-1.75; 38 5.75,-1.25; 39 5.75,-0.75; 40 5.75,-0.25; 41 5.75,0.25; 42 5.75,0.75; 43 5.75,1.25; 44 5.75,1.75; 45 5.75,2.25; 46 5.75,2.75; 47 5.75,3.25; 48 5.75,3.75 | smd 0.3 x 1.2: 17 -3.75,-5.75; 18 -3.25,-5.75; 19 -2.75,-5.75; 20 -2.25,-5.75; 21 -1.75,-5.75; 22 -1.25,-5.75; 23 -0.75,-5.75; 24 -0.25,-5.75; 25 0.25,-5.75; 26 0.75,-5.75; 27 1.25,-5.75; 28 1.75,-5.75; 29 2.25,-5.75; 30 2.75,-5.75; 31 3.25,-5.75; 32 3.75,-5.75; 49 3.75,5.75; 50 3.25,5.75; 51 2.75,5.75; 52 2.25,5.75; 53 1.75,5.75; 54 1.25,5.75; 55 0.75,5.75; 56 0.25,5.75; 57 -0.25,5.75; 58 -0.75,5.75; 59 -1.25,5.75; 60 -1.75,5.75; 61 -2.25,5.75; 62 -2.75,5.75; 63 -3.25,5.75; 64 -3.75,5.75
PVQFN-N48 = smd 0.28 x 0.85: 1 2.75,3.475; 2 2.25,3.475; 3 1.75,3.475; 4 1.25,3.475; 5 0.75,3.475; 6 0.25,3.475; 7 -0.25,3.475; 8 -0.75,3.475; 9 -1.25,3.475; 10 -1.75,3.475; 11 -2.25,3.475; 12 -2.75,3.475; 25 -2.75,-3.475; 26 -2.25,-3.475; 27 -1.75,-3.475; 28 -1.25,-3.475; 29 -0.75,-3.475; 30 -0.25,-3.475; 31 0.25,-3.475; 32 0.75,-3.475; 33 1.25,-3.475; 34 1.75,-3.475; 35 2.25,-3.475; 36 2.75,-3.475 | smd 0.85 x 0.28: 13 -3.475,2.75; 14 -3.475,2.25; 15 -3.475,1.75; 16 -3.475,1.25; 17 -3.475,0.75; 18 -3.475,0.25; 19 -3.475,-0.25; 20 -3.475,-0.75; 21 -3.475,-1.25; 22 -3.475,-1.75; 23 -3.475,-2.25; 24 -3.475,-2.75; 37 3.475,-2.75; 38 3.475,-2.25; 39 3.475,-1.75; 40 3.475,-1.25; 41 3.475,-0.75; 42 3.475,-0.25; 43 3.475,0.25; 44 3.475,0.75; 45 3.475,1.25; 46 3.475,1.75; 47 3.475,2.25; 48 3.475,2.75 | drill 0.305: P1 -2,2; P2 -1,2; P3 0,2; P4 1,2; P5 2,2; P6 -2,1; P7 -1,1; P8 0,1; P9 1,1; P10 2,1; P11 -2,0; P12 -1,0; P13 0,0; P14 1,0; P15 2,0; P16 -2,-1; P17 -1,-1; P18 0,-1; P19 1,-1; P20 2,-1; P21 -2,-2; P22 -1,-2; P23 0,-2; P24 1,-2; P25 2,-2 | smd 5.15 x 5.15: PAD 0,0
TSSOP14 = smd 0.305 x 0.991: 1 -1.95,-2.918; 2 -1.3,-2.918; 3 -0.65,-2.918; 4 0,-2.918; 5 0.65,-2.918; 6 1.3,-2.918; 7 1.95,-2.918; 8 1.95,2.918; 9 1.3,2.918; 10 0.65,2.918; 11 0,2.918; 12 -0.65,2.918; 13 -1.3,2.918; 14 -1.95,2.918
TDFN10 = smd 0.7 x 0.3: 1 -1.475,1; 2 -1.475,0.5; 3 -1.475,0; 4 -1.475,-0.5; 5 -1.475,-1; 6 1.475,-1; 7 1.475,-0.5; 8 1.475,0; 9 1.475,0.5; 10 1.475,1 | smd 1.58 x 2.35: PAD 0,0
21-0137I_T1433-1 = smd 0.711 x 0.254: 1 -1.499,1.2; 2 -1.499,0.8; 3 -1.499,0.4; 4 -1.499,0; 5 -1.499,-0.4; 6 -1.499,-0.8; 7 -1.499,-1.2; 8 1.499,-1.2; 9 1.499,-0.8; 10 1.499,-0.4; 11 1.499,0; 12 1.499,0.4; 13 1.499,0.8; 14 1.499,1.2 | smd 1.803 x 2.388: 15 0,0
M2MOUNT = drill 2.1: P$1 0,0
12AWG_PAD = drill 2.8: 1 0,0
ABM3B = smd 1.8 x 1.2: 1 -2,-1.2; 2 2,-1.2; 3 2,1.2; 4 -2,1.2

### Placement (x,y rotation side)
A  15.4,1.7 0 top
ABS_3V  15.1,43.1 0 top
ABS_GND  15.1,41.5 0 top
ABS_SCL  16.6,41.5 0 top
ABS_SDA  16.6,43.1 0 top
B  23,1.7 0 top
C  30.1,1.7 0 top
C1  26.52,29.33 90 top
C2  23.06,37.13 0 top
C3  11.97,38.05 90 top
C4  11.46,25.87 180 top
C5  21.73,25.43 0 top
C6  8.68,29.97 180 top
C7  20.61,23.83 0 top
C8  4.23,34.7 270 top
C9  6.24,29.96 180 top
C10  22.3,21.98 180 top
C11  26.9,24.63 0 top
C12  26.9,25.9 0 top
C13  14.47,13.6 270 top
C14  23.76,9.6 90 top
C15  26.08,9.6 90 top
C16  11.76,9.6 90 top
C17  14.1,9.6 90 top
C18  28.42,9.6 90 top
C19  30.72,9.6 90 top
C20  3.58,23.1 0 top
C21  10.3,18.75 270 top
C22  11.48,13.6 90 top
C23  13.16,13.6 90 top
C24  17.3,23.8 0 top
C25  12.1,23.8 180 top
C26  8.68,28.7 180 top
C27  13.3,42.5 270 top
C28  8.5,15.6 180 top
C29  8.68,27.44 180 top
C30  29.3,34 0 top
C31  29.3,32.7 0 top
C32  38.1,8.4 90 top
C33  39.3,14.7 270 top
C34  37,14.7 270 top
C35  34.7,14.7 270 top
C36  38.7,11.4 180 top
C37  27.4,13.2 0 top
C38  8.5,11.2 180 top
D1  8,20.5 90 top
D2  30.2,30.8 0 top
D3  30.2,29 0 top
DA  12.1,2.2 0 top
DAC1  13.9,24.6 0 top
DB  20.3,1.9 0 top
DC  27.6,1.6 0 top
DGND  10.7,41.8 0 top
DRX  16,39.3 0 top
DTX  17.4,39 0 top
J1  31.2,22.5 90 top
J2  39.3,22.5 90 top
L1  3.6,19.8 0 top
LNK  23.9,40.6 180 top
M3  5.5,26.4 0 top
Q1  13.37,4.8 0 top
Q2  17.64,4.8 180 top
Q3  24.88,4.8 0 top
Q4  21.3,4.8 180 top
Q5  29.55,4.8 0 top
Q6  33.75,4.8 180 top
R1  14.74,39.36 270 top
R2  10.3,16.4 90 top
R4  8.5,13 180 top
R5  11.7,40.2 0 top
R6  33.4,29.3 180 top
R7  7.83,25.14 0 top
R8  4.82,25.14 0 top
R9  33.4,30.7 180 top
R11  8.5,14.34 0 top
R12  36.7,5.9 90 top
R13  36.7,8.4 90 top
RA  18.2,9.6 270 top
RB  21.4,9.6 270 top
RC  34.5,9.6 270 top
SH1  17.8,11.95 90 top
SH2  20.9,11.94 90 top
SH3  33.63,12.03 90 top
SH4  6.6,23.1 0 top
SWD  35.8,35.6 135 top
TEMP1  8.1,39.2 0 top
TEMP2  9.3,40.4 0 top
U1  16.68,31.72 0 top
U2  15.05,19.22 180 top
U3  22.5,22.5 180 bottom
U4  26.6,22.4 0 top
U5  28.7,36.5 180 top
U$1  42.5,30.1 0 top
U$2  2.5,30.1 0 top
U$3  2.5,14.9 0 top
U$4  42.5,14.9 0 top
V+  7.7,7.8 0 top
V-  4.4,11 0 top
X1  7.5,34.05 270 top

### Tracks (layer width: path | path; a pad name or v marks a point on that pad's centre or on a via)
+3V3  (via drill 0.4, 0.5)
  Top 0.127: U5.3 31,36.1 v31.1,36.2 | 36.4,5.4 R12.P$1 36.45,5.35 35.72,6 35.72,17.1 v34.9,18 35,18
  Top 0.2: 28.8,33.65 C30.P$1 | U5.14 27.7,34.8 v27.7,34.6 28.15,34.6 C30.P$1 | U5.1 30.1,35.3 29.4,34.6 29.35,34.6 C30.P$1
  Top 0.254: L1.1 2.08,18.87 6.61,14.34 R11.P$1 | U1.64 12.9,37.5 C3.P$1 12,37.47 v12,36.7 | U1.1 12.13,35.47 v12.4,35.5 | C2.P$1 v22.51,36.31 v22.5,36.3 22.5,35.54 U1.48 | SWD.6 32.75,38.15 v32.5,37.9 | R9.P$1 34.2,30.7 v35,29.9 34.4,29.3 R6.P$1 | v26.3,26.8 26.35,26.75 C12.P$1 C11.P$1 | C11.P$1 26.05,24.62 U4.1 | C11.P$1 26.68,23.9 27.8,23.9 28.07,23.62 U4.10 | C10.P$1 22.85,21.45 v22.4,21 | v20.42,27.36 20.43,26.57 U1.32 20.97,25.43 C5.P$1 | v18.54,23.81 v18.53,23.8 C24.P$2 17.3,23.25 U2.26 | U1.19 v13.93,28 12.8,28 12.01,27.11 C4.P$1 | U1.13 10,29.47 C26.P$1 C29.P$1 8.36,26.57 v8.28,26.57
  Top 0.406: C27.P$1 12.65,43.05 v12.4,43 | C1.P$1 27.22,28.02 v27.3,28 | v20.4,39.9 20.45,40.45 LNK.6 | C30.P$1 C31.P$1
  Top 0.813: L1.1 2.08,23.18
  Bottom 0.254: U3.12 21.85,20.45 v22.4,21
  other vias: 0.8,24.1 0.9,25.3 2.2,25.3
  pour Route15: 0.3,30.9 2.1,34.6 10.4,42.9 14.1,44.7 30.9,44.7 34.7,42.8 42.9,34.6 44.7,30.9 44.7,17.6 20.1,17.6 20.1,23.8 6.4,23.8 6.4,22 0.3,22
  pour Top (no thermals): 2.8,23.1 0.3,23.1 0.3,26.1 2.8,26.1
AS5047_A  (via drill 0.3)
  Top 0.127: v24.4,26.4 24.2,26.6 24.2,29.2 23.4,30 22.6,30 U1.37
  Bottom 0.127: v24.4,26.4 24.4,25.6 U3.7
AS5047_B  (via drill 0.3)
  Top 0.127: v24.8,29.4 24.4,29.4 23.4,30.4 22.6,30.4 U1.38
  Bottom 0.127: U3.6 23.8,28.4 v24.8,29.4
AS5047_CS  (via drill 0.3)
  Top 0.127: v21.6,26.6 22.4,27.4 22.4,28 U1.33
  Bottom 0.127: v21.6,26.6 20.6,26.6 20.6,25.6 U3.1
AS5047_MISO  (via drill 0.3)
  Top 0.127: v21.6,27.4 21.6,28.8 21.8,29 22.4,29 U1.35
  Bottom 0.127: v21.6,27.4 22.2,27.4 22.2,26.4 22,26.2 22,25.6 U3.3
AS5047_MOSI  (via drill 0.3)
  Top 0.127: v23.6,29 23.2,29.4 22.6,29.4 U1.36
  Bottom 0.127: v23.6,29 22.6,29 22.6,25.6 U3.4
AS5047_SCK  (via drill 0.3)
  Top 0.127: v23.4,23.8 23.4,28.2 23.2,28.4 22.6,28.4 U1.34
  Bottom 0.127: U3.2 21.2,23.8 v23.4,23.8
CUR1  (via drill 0.3)
  Top 0.127: v18.4,22.8 17.8,22.8 U2.25 | v17.6,24.8 17,25.2 17,25.8 U1.25
  Bottom 0.127: v18.4,22.8 17.6,23.6 v17.6,24.8
CUR2  (via drill 0.3)
  Top 0.127: v19.2,24.6 19.2,22.6 18.6,22 U2.24 | v16.6,27.2 17.4,27.2 17.4,26 U1.26
  Bottom 0.127: v16.6,27.2 v19.2,24.6
CUR3  (via drill 0.3)
  Top 0.127: v19.4,21.6 18.6,21.6 U2.23 | v18.6,27.2 18,26.6 18,26 U1.27
  Bottom 0.127: v19.4,21.6 19.4,24 19.8,24.4 19.8,26.6 19.2,26.6 v18.6,27.2
DBG_A
  Top 0.127: U5.12 26.4,36.1 24.5,38 24.5,39.5 23.1,39.5 22,40.6 22,42.55 LNK.5
DBG_B
  Top 0.127: U5.11 26.5,36.5 25,37.9 25,39.7 24.7,39.9 24.3,39.9 23.5,40.7 23.5,42.55 LNK.4
DBG_Y
  Top 0.127: U5.9 26.6,37.3 25.8,38.1 25.8,39 26.5,39.7 26.5,42.55 LNK.2
DBG_Z
  Top 0.127: U5.10 26.5,36.9 25.4,38 25.4,40.4 25,40.8 25,42.55 LNK.3
DEBUG_RX  (via drill 0.3)
  Top 0.127: U1.52 18.93,38.43 19.2,38.7 v21.6,38.7 | v31.4,35.1 30.8,35.7 U5.2
  Bottom 0.127: v21.6,38.7 21.6,38.6 21.1,38.1 21.1,37.6 21.5,37.2 23.3,37.2 24.3,36.2 29.9,36.2 v31.4,35.1
DEBUG_TX  (via drill 0.3)
  Top 0.127: U1.51 19.43,38.23 19.6,38.4 20.9,38.4 v21.8,37.8 | v32.1,36.4 31.6,36.9 U5.5
  Bottom 0.127: v21.8,37.8 28,37.8 28.9,36.9 31.6,36.9 v32.1,36.4
DRV8323_CS  (via drill 0.3)
  Top 0.127: v14.21,23.58 14.2,22.8 U2.32 | v21,30.4 21.6,31 22.4,31 U1.39
  Route2 0.127: v14.21,23.58 14.2,23.8 14.66,24.16 14.66,24.86 15.2,25.2 15.8,25.2 v21,30.4
DRV8323_MISO
  Top 0.127: U2.29 15.8,25 15.4,25.4 15.4,25.8 U1.22
DRV8323_MOSI  (via drill 0.3)
  Top 0.127: v15.2,24.4 15.2,22.8 U2.30 | v15.2,27.2 15.8,27.2 15.8,26 U1.23
  Bottom 0.127: v15.2,27.2 v15.2,24.4
DRV8323_SCLK
  Top 0.127: U2.31 14.8,24 14.66,24.19 14.66,24.99 14.8,25.2 14.8,25.8 U1.21
GHA
  Top 0.254: Q1.4 15.4,4.11 15.42,13.6 15.8,14 U2.8
GHB
  Top 0.254: Q3.4 27.2,4.59 27.2,14.3 27.1,14.4 24,14.4 19.93,18.47 U2.17
GHC
  Top 0.254: Q5.4 31.2,3.92 31.2,6.5 31.8,7.1 31.8,12.2 29.1,14.9 24.3,14.9 20.23,18.97 U2.18
GLA
  Top 0.254: U2.10 16.8,13.5 16.4,13.1 16.4,6.62 Q2.4
GLB
  Top 0.254: Q4.4 19.7,6.97 19.7,14.8 20.8,15.9 19.23,17.47 U2.15
GLC
  Top 0.254: Q6.4 32.77,12.62 29.4,16 24.7,16 20.73,19.97 U2.20
GND  (via drill 0.4)
  Top 0.127: 5.76,23.3 SH4.2 C20.P$2 5.03,24.18 5,24.21 | v31.3,37.6 31.1,37.3 U5.6 29.2,37.3 29.2,37 U5.15 U5.4 | 36.6,9 R13.P$2 | R13.P$2 C32.P$2 | v37.1,18 36,16.9 36,10.1 36.7,9.4 R13.P$2
  Top 0.2: 29.9,33.95 C30.P$2 | LNK.1 27.95,40.45 v27.9,40 | U5.8 26.8,38 v26.8,38.9
  Top 0.254: v3.3,34.1 4.18,34.1 C8.P$2 | X1.2 5.25,32.05 v5.2,32 | X1.4 v8.7,37.4 | C9.P$2 5.69,29.19 v5.6,29.1 | 5,24.21 R8.P$1 | 12.07,38.7 v12.8,38.7 13.4,38.4 13.43,38.37 U1.63 | 12.07,38.7 C3.P$2 | C1.P$2 26.52,30.68 v26.3,31 | v24.4,37.2 24.33,37.13 C2.P$2 23.62,34.97 U1.47 | SWD.4 35.03,36.03 v34.7,35.7 | J1.3 33.74,25.66 v33.7,25.7 | J2.3 41.84,25.66 v41.8,25.7 | C26.P$2 7.39,28.7 v7,28.3 | v10.2,25.9 10.84,25.9 C4.P$2 | C26.P$2 C6.P$2 | v26.6,20.3 26.98,20.3 U4.6 27.6,21.4 U4.PAD | C11.P$2 28.37,24.63 v28.4,24.6 | C12.P$2 v28.4,25.9 | C10.P$2 21.73,22 v21,22 | C7.P$2 21.39,23.8 v21.39,22.89 | C5.P$2 22.28,24.42 v22.4,24.4 | U1.31 19.93,26.9 v19.52,27.34 | v16.76,24.61 C24.P$1 16.8,23.75 U2.27 | U1.18 13.43,27.05 v13.19,27.29 | v12.6,24.6 12.65,24.55 C25.P$1 12.8,23.65 U2.35 | U1.12 12.07,29.97 v12.69,29.39 | C26.P$2 C29.P$2 | U1.3 12.4,34.47 v12.4,34.4 | 12.07,38.7 12.25,38.88 R5.P$2 | R1.P$1 v13.9,39.9
  Top 0.305: 12.83,38.67 v12.8,38.7
  Top 0.406: C27.P$2 12.55,41.95 v12.3,41.9 | C31.P$2 30.3,32.7 v30.9,34 C30.P$2
  Bottom 0.254: U3.13 21.2,22 v21,22 | U3.5 23.15,24.4 v22.4,24.4
  other vias: 3.7,23.8 3.7,22.9
  pour Route2: 0.3,30.9 2.1,34.6 10.4,42.9 14.1,44.7 30.9,44.7 34.7,42.8 42.9,34.6 44.7,30.9 44.7,17.6 20.1,17.6 20.1,23.8 6.4,23.8 6.4,22 0.3,22
  pour Top (no thermals): 3.3,24.2 3.3,22.3 5.2,22.3 5.2,24.2
I2C_ABS_SCL
  Top 0.127: 14.38,37.58 U1.61 14.4,37.6 14.4,38.2 13.2,39.4 13.2,40 13.8,40.6 16.6,40.6 ABS_SCL.P$1
I2C_ABS_SDA  (via drill 0.3)
  Top 0.127: v14,36.4 14,37.4 U1.62
  Bottom 0.127: v14,36.4 14,39.2 14.8,39.2 16.2,40.6 16.8,40.6 17.4,41.2 17.4,43 16.6,43 ABS_SDA.P$1
LED1
  Top 0.127: D3.CATHODE 29.4,29 25,33.4 22.6,33.4 U1.44
LED2
  Top 0.127: D2.CATHODE 28,30.8 24.8,34 22.6,34 U1.45
MOTOR1  (via drill 0.3)
  Top 0.127: v11.6,22.6 11.6,22 U2.37 | v12,28 11.8,28.2 11.8,28.8 11.6,29 11,29 U1.14
  Bottom 0.127: v11.6,22.6 11.6,28 v12,28
MOTOR2
  Top 0.127: U2.39 11.4,21 10.4,21 10.4,22.4 10.2,22.6 10.2,23.6 9.4,24.4 7.9,24.4 7.9,25.6 8.24,26 8.6,26 9.02,26.42 9.4,26.42 10.1,27.22 10.1,28.4 10.8,28.4 U1.15
MOTOR3  (via drill 0.3)
  Top 0.127: v9.8,20 9.8,19.8 10.8,19.8 11,20 11.4,20 U2.41 | v9.2,25.8 10.8,27.6 10.8,28 U1.16
  Bottom 0.127: v9.8,20 8.8,21 8.8,25.8 | v9.2,25.8 8.8,25.8 | 8.8,25.8 6.1,25.8 M3.P$1
MOTOR_ENABLE
  Top 0.127: U2.33 13.8,23.2 13.16,23.7 13.16,24.9 13,25.2 13,25.8 U1.17
MOTOR_FAULT
  Top 0.127: U2.28 16.2,22.8 16.2,25.2 16.4,25.4 16.4,25.8 U1.24
MOTOR_HIZ  (via drill 0.3)
  Top 0.127: 12.2,20.2 12.2,19.6 11.6,19.6 U2.42 | 12.2,20.2 12,20.4 11.6,20.4 U2.40 11.4,20.4 v10.6,20.4 | 12.2,20.2 12.2,21.4 11.6,21.4 U2.38 | v12.5,30.4 11.4,30.4 11,30.5 U1.11
  Bottom 0.127: v12.5,30.4 10.8,29.8 10.8,23.6 10.4,23.6 10.2,23.4 10.2,20.4 v10.6,20.4
N$1
  Top 0.127: U1.20 14.43,25.13 DAC1.P$1
N$2
  Top 0.127: U1.58 15.93,38.03 16.1,38.3 17.1,38.3 DTX.P$1
N$3
  Top 0.127: U1.59 15.43,38.13 DRX.P$1
N$5
  Top 0.254: R2.P$1 10.92,16.47 U2.48
N$6  (via drill 0.3)
  Top 0.127: v20.4,36.4 20.4,37.4 U1.49 | v25.2,35.4 25.5,35.4 25.9,34.7 25.9,34 27.7,32.1 32.5,32.1 33.4,33.1 33.4,36.4 SWD.5
  Bottom 0.127: v20.4,36.4 21.2,35.6 24.8,35.6 v25.2,35.4
N$7
  Top 0.127: U1.46 22.6,34.4 25,34.4 27.6,31.8 32.7,31.8 34.8,34.4 35.4,34.4 SWD.3
N$8
  Top 0.254: U2.1 11.55,15.1 11.06,15.1 10.3,14.34 R11.P$2
  Top 0.305: R4.P$1 R11.P$2
N$9
  Top 0.254: U4.9 33.34,22.9 arc-90 J1.2
  Top 0.406: J2.2 J1.2
N$10
  Top 0.254: C22.P$2 12.53,15.05 13.1,15.05 13.1,15.1 13.3,15.3 U2.3
N$11
  Top 0.254: U2.45 10.53,17.97 C21.P$2
  Top 0.61: C21.P$2 8.3,18.2 D1.CATHODE
  Top 0.813: L1.2 6.7,19.8 D1.CATHODE
N$12
  Top 0.254: C21.P$1 10.3,19.17 11,18.47 U2.44
N$13
  Top 0.254: U2.4 13.8,15.1 13.46,14.66 12.75,14.66 12.19,14.1 12.19,13.85 C22.P$1
N$14
  Top 0.254: U2.5 14.3,14.9 13.55,14.15 C23.P$2
N$15
  Top 0.254: U4.8 29.6,22.4 31.5,20.5 J1.1
  Top 0.406: J2.1 J1.1
N$16
  Top 0.254: U2.36 11.55,23.45 C25.P$2
N$17
  Top 0.127: R6.P$2 32.8,29.2 31,29.2 31,29 D3.ANODE
N$18
  Top 0.127: D2.ANODE 32.8,30.8 R9.P$2
N$23
  Top 0.127: 19.43,25.55 19.4,25.8 U1.30 | 19.8,24 C7.P$1
  Top 0.254: 19.8,24 19.8,24.8 19.43,25.35 19.43,25.55
N$24  (via drill 0.3)
  Top 0.127: C6.P$1 9.4,30 10,30.6 10,32.2 10.2,32.4 10.8,32.4 U1.7 11,32.6 11.6,32.6 v12.4,33.4 | v34.9,33.1 35,33.1 35.3,33.4 36.4,33.4 SWD.2
  Bottom 0.127: v12.4,33.4 33.9,33.4 34.2,33.1 v34.9,33.1
N$33
  Top 0.127: 15,38.7 15,37.6 U1.60
  Top 0.305: 15,38.7 15,38.93 R1.P$2
N$35
  Top 0.254: C8.P$1 5.03,36.05 X1.1 8.88,33.47 U1.5
N$36
  Top 0.254: C9.P$1 8.7,31.87 X1.3 9.62,32.97 U1.6
RS485_DIR
  Top 0.127: U4.4 25.2,22 25.2,22.4 U4.3 23.4,22.4 23.4,23 22.8,23.6 22.8,24 23,24.2 23,25.6 22.6,26 21,26 21,28.6 20.4,29.2 20.4,31.4 21,32 22.4,32 U1.41
RS485_RX
  Top 0.127: U4.2 25,23 24.4,23 24.4,25.2 25.4,26.2 25.4,30.6 23,33 22.6,33 U1.43
RS485_TX  (via drill 0.3)
  Top 0.127: v25.2,20.8 25.2,21.4 U4.5 | v24.4,30.8 23.4,31.8 23.4,32.2 23.2,32.4 22.6,32.4 U1.42
  Bottom 0.127: v25.2,20.8 25.2,26 25.4,26.2 25.4,30.8 v24.4,30.8
SHA
  Top 0.127: Q2.PAD 17.64,3.58 Q2.7
  Top 0.254: Q2.PAD 15.9,5.7 15.9,13.3 16.3,13.7 U2.9
  pour Top (no thermals): 11.4,3.4 13.9,3.4 13.9,3 14,2.9 15.9,2.9 16.4,3.4 18.9,3.4 18.9,0.3 14,0.3 11.4,1.6
SHB
  Top 0.127: Q4.PAD 21.3,3.58 Q4.7
  Top 0.254: U2.16 19.53,17.97 22.7,14.8 22.7,7 23,6.6 23,3.2 22.32,3.2 Q4.8
  pour Top (no thermals): 19.8,3.4 19.8,0.3 25.4,0.3 25.4,3.4
SHC
  Top 0.127: Q6.PAD 33.75,3.58 Q6.7
  Top 0.254: U2.19 20.53,19.47 24.5,15.5 29.2,15.5 32.3,12.3 32.3,7 31.6,6.2 31.6,3.2 32.73,3.2 Q6.5
  pour Top (no thermals): 27.1,3.4 30,3.4 30,2.9 30.8,2.9 31.3,3.4 34.9,3.4 34.9,2.4 34.7,2.2 30.8,0.3 27.1,0.3
SNA
  Top 0.254: U2.12 SH1.1
SNB  (via drill 0.5)
  Top 0.254: SH2.1 v20.9,13.6 | v18.53,15.68 U2.13
  Bottom 0.254: v20.9,13.6 19.9,14.9 19.21,14.9 v18.53,15.68
SNC
  Top 0.254: U2.22 21.13,20.97 25.1,17 29.93,17 33.62,13.13 33.62,12.82 SH3.1
SPA
  Top 0.254: RA.2 16.9,8.2 16.9,12.8 17.3,13.2 U2.11
  pour Top (no thermals): 17.1,8.3 17.1,6.1 19.3,6.1 19.3,8.3
SPB  (via drill 0.5)
  Top 0.254: RB.2 20.1,8.2 20.1,14.3 20.8,14.9 v21.2,14.9 | v19.6,16 19.6,16.48 19.11,16.97 U2.14
  Bottom 0.254: v21.2,14.9 20.7,14.9 v19.6,16
  pour Top (no thermals): 20.8,8.6 20.8,8.4 20.4,8 20.4,7.4 20.8,7 20.8,6.2 22.5,6.2 22.5,6.7 22.3,6.9 22.3,8.6
SPC
  Top 0.254: U2.21 20.93,20.47 24.9,16.5 29.6,16.5 33.2,12.9 33.2,8.1 34.4,8.1 RC.2
  pour Top (no thermals): 33.5,8 33.5,7.3 33.3,7 33.3,6.1 35.5,6.1 35.5,8
V+  (via drill 0.4, 0.5)
  Top 0.127: Q5.PAD 29.55,6.03 Q5.6 | Q3.PAD 24.88,6.03 Q3.6 | Q1.PAD 13.37,6.03 Q1.6 | 14.8,15.8 U2.6
  Top 0.254: R7.P$2 9.59,25.14 10.8,23.93 v10.8,23 | U2.6 14.83,15.71 14.8,15.69 14.8,14.6 14.47,14.27 C13.P$1 14.25,14.24 C23.P$1 v13.16,12.3 | U2.47 10.32,16.97 R2.P$2 10.3,16.85 C28.P$1 v9.76,15.1 | U2.7 15.3,14.3 15.03,14.03 15.03,12.67 v14.66,12.3
  other vias: 12.3,7 13.3,7 14.3,7 23.9,6.9 24.9,6.9 25.9,6.9 28.1,6.9 29.2,6.9 30.2,6.9 34.05,15.22 35.05,15.22 36.65,15.22 37.65,15.22 38.65,15.22 39.65,15.22 41.15,11.92 41.15,10.92 24.85,13.62 24.85,12.62
  pour Route15: 0.3,21.7 6.8,21.7 6.8,23.5 19.7,23.5 19.8,17.2 44.7,17.2 44.7,14.2 42.9,10.4 34.7,2.2 30.8,0.3 14.1,0.3 10.4,2.1 2.1,10.4 0.3,14.1
  pour Top (no thermals): 10.9,7.9 14.9,7.9 14.9,5.8 10.9,5.8
  pour Top (no thermals): 23.1,7.8 23.1,7 23.6,6.5 23.6,5.1 26.2,5.1 26.2,6.5 26.8,7.1 26.8,7.8
  pour Top (no thermals): 27.6,8.1 27.6,6.5 28.3,5.8 30.8,5.8 30.8,6.8 31.4,7.4 31.4,8.1
  pour Bottom (no thermals): 9.9,7.5 38.3,7.5 38.3,5.7 35.7,3.1 9.9,3.1
  pour Top (no thermals): 33.4,16.1 35.5,16.1 35.5,14.86 33.4,14.86
  pour Top (no thermals): 36.2,16.1 36.2,14.85 40.1,14.85 40.1,16.1
  pour Top (no thermals): 40.3,12.4 41.8,12.4 41.8,10.4 40.3,10.4
  pour Top (no thermals): 25.7,14 24.3,14 24.3,12.2 25.7,12.2
  pour Top (no thermals): 10.6,11 9.3,11 6.8,8.5 8.2,7.1 10.6,9.5
V-  (via drill 0.5)
  Top 0.127: RC.1 34.5,11.49 SH3.2 | RB.1 21.4,11.27 SH2.2 | SH4.1 7.4,23.1 D1.ANODE
  Top 0.254: R4.P$2 5.5,13 V-.1 | RA.1 17.8,11.4 SH1.2 | U2.2 12.8,17.22 U2.P5 | U2.43 12.8,18.97 U2.P15 | C13.P$2 14.14,13.04 14,12.9 14.03,10.97 14.5,11 14.83,9.83 v14.6,9.6
  Top 0.406: C28.P$2 v7.1,15.6
  other vias: 34,9.6 35,9.6 34.94,12.4 31,9.6 30,9.6 29,9.6 28,9.6 26.4,9.6 25.4,9.6 24.4,9.6 23.4,9.6 20.8,9.6 21.9,9.6 21.8,12.4 17.6,9.6 18.8,9.6 18.7,12.4 13.5,9.6 12.3,9.6 11.3,9.6 9.5,23.3 9.5,22.3 9.5,21.3 36.64,14.2 37.64,14.2 39.64,14.2 38.24,10.9 38.24,11.9 38.64,14.2 35.06,14.2 34.04,14.2 27.9,13.6 27.9,12.6
  pour Route2: 0.3,21.7 6.8,21.7 6.8,23.5 19.8,23.5 19.8,17.2 44.7,17.2 44.7,14.2 42.9,10.4 34.7,2.2 30.8,0.3 14.1,0.3 10.4,2.1 2.1,10.4 0.3,14.1
  pour Top (no thermals): 33.6,11.2 33.6,9.2 35.4,9.2 35.4,11.2
  pour Top (no thermals): 34.4,11.4 34.4,12.9 35.5,12.9 35.5,11.4
  pour Top (no thermals): 27.6,11 27.6,9.2 31.4,9.2 31.4,11
  pour Top (no thermals): 23,11 23,9.2 26.8,9.2 26.8,11
  pour Top (no thermals): 20.4,10.8 20.4,9.2 22.4,9.2 22.4,10.8
  pour Top (no thermals): 21.2,12.9 21.2,11.6 22.3,11.6 22.3,12.9
  pour Top (no thermals): 17.2,10.8 17.2,9.2 19.2,9.2 19.2,10.8
  pour Top (no thermals): 18.1,12.9 18.1,11.6 19.2,11.6 19.2,12.9
  pour Top (no thermals): 10.9,10.8 10.9,9.2 15,9.2 15,10.8
  pour Top (no thermals): 7.2,23.7 10,23.7 10,20.8 7.2,20.8
  pour Bottom (no thermals): 9.9,12.6 38.3,12.6 38.3,7.8 9.9,7.8
  pour Top (no thermals): 33.9,13.6 33.39,14.2 33.39,14.57 35.5,14.57 35.5,13.6
  pour Top (no thermals): 36.2,13.2 36.2,14.57 40.1,14.57 40.1,13.2
  pour Top (no thermals): 37.4,12.4 38.9,12.4 38.9,10.4 37.4,10.4
  pour Top (no thermals): 28.8,14.1 27.5,14.1 27.5,12.1 28.8,12.1
  pour Top (no thermals): 5.8,12.1 7.2,12.1 7.2,10.1 5.8,10.1
VBAT_SENSE  (via drill 0.3)
  Top 0.127: R8.P$2 5.6,25.2 7,25.2 R7.P$1 7.2,25.2 v7.2,27 | v13.4,31.6 11,31.6 U1.9
  Bottom 0.127: v13.4,31.6 11.8,31.6 v7.2,27
VTEMP_FET  (via drill 0.3)
  Top 0.127: R13.P$1 R12.P$2 | 36.7,7.9 R13.P$1 | 37.95,8 36.8,8 R13.P$1 | v39.7,8 37.95,8 | v12,31 11,31 U1.10 | 37.95,8 C32.P$1
  Bottom 0.127: v39.7,8 43.1,11 44.6,14.3 44.6,18.8 20.4,18.8 15.8,23.4 15.8,31 v12,31
VTEMP_MOT
  Top 0.127: U1.8 11,32 13,32 13,36.1 11.4,36.1 11.4,40.2 R5.P$1
  Top 0.2: 11.4,40.2 9.5,40.2 TEMP2.P$1

### Text on the board
tPlace: ABS | 3V | SD | 3V | RX | TX | G | G | G | TEMP | SC | RX | TX | GND | B | A | moteus r3.1 | (c) jjp@pobox.com | 2019 | - | +12V | A | B | C